# Altium schematic sheet Communication.SchDoc: Communication
size A4; DrawnBy: Alvin Ha; DocumentNumber: MCU2018-4; Revision: 2.0; SheetNumber: 4; SheetTotal: 4
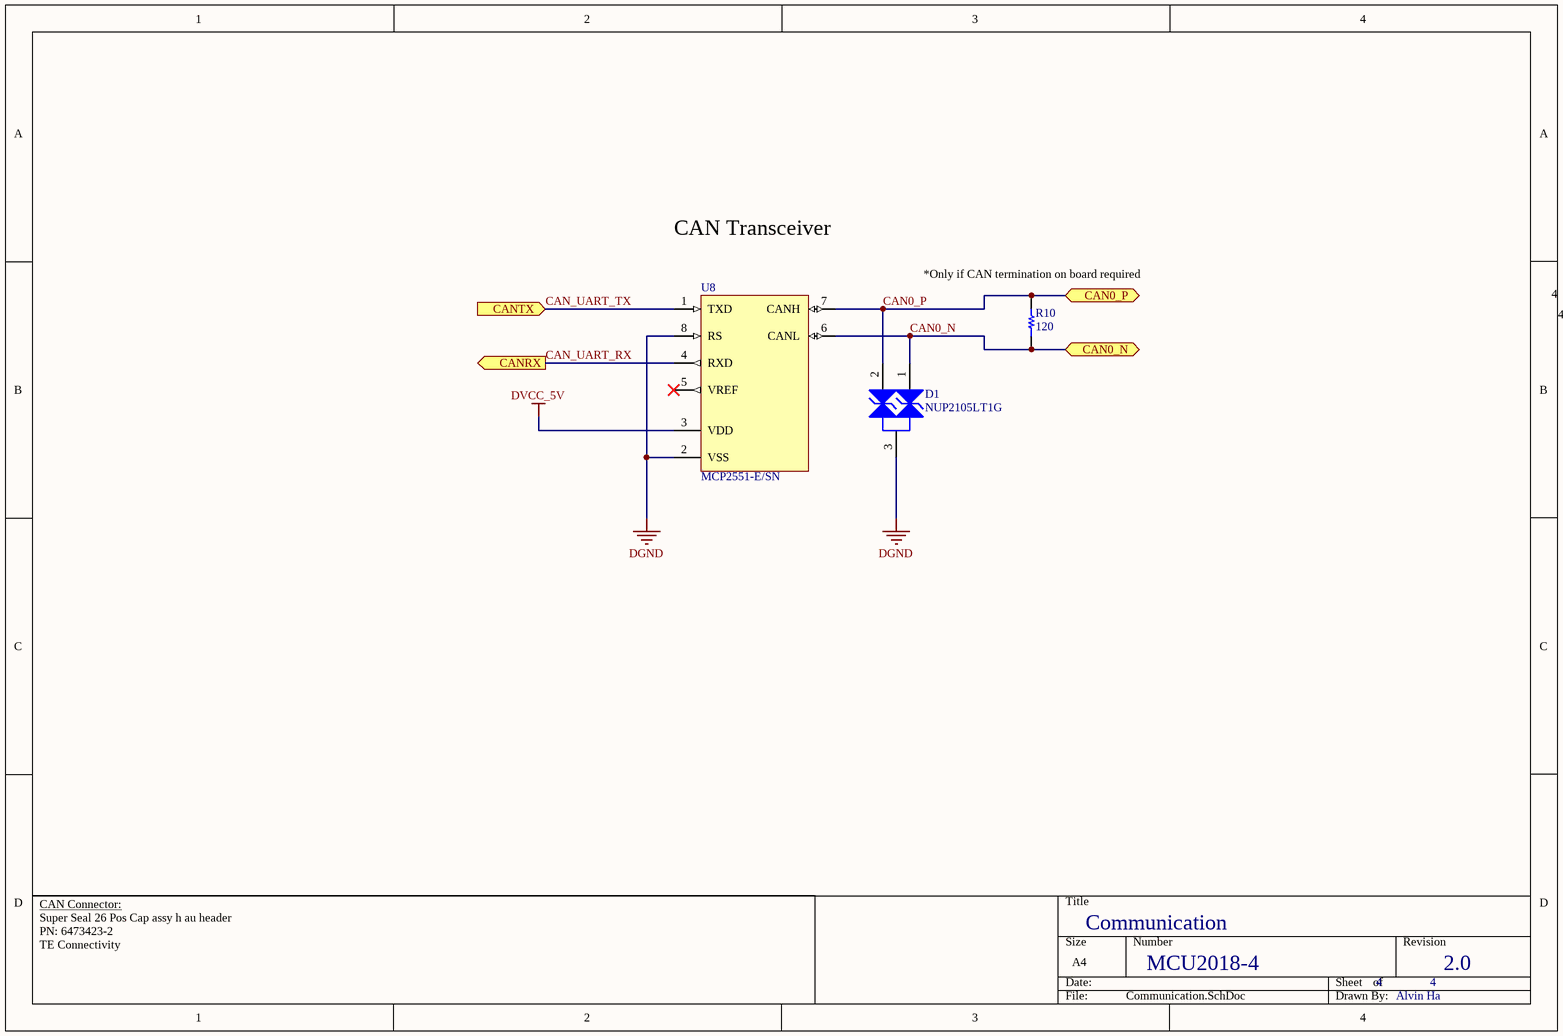
[diagram p0: Communication.SchDoc]

## Parts
D1  NUP2105LT1G  [ONSC-SOT-23-3-318-08_V]
R10  120  [RES SMT 0805]
U8  MCP2551-E/SN  [SOIC-SN8_N]

## Ports
CAN0_N (bidir), CAN0_P (bidir), CANRX (out), CANTX (in)

## Nets
DGND: D1.3(K) U8.2(VSS) U8.8(RS)
DVCC_5V: U8.3(VDD)
CAN0_N: D1.1(K) R10.1 U8.6(CANL) ; port CAN0_N
CAN0_P: D1.2(K) R10.2 U8.7(CANH) ; port CAN0_P
CAN_UART_RX: U8.4(RXD) ; port CANRX
CAN_UART_TX: U8.1(TXD) ; port CANTX

Not connected (* = marked no-connect by the designer): U8 5(VREF)*

## Notes on the sheet
- CAN Transceiver
- (near R10) *Only if CAN termination on board required
- CAN Connector:
- Super Seal 26 Pos Cap assy h au header
  PN: 6473423-2
  TE Connectivity

## Library data of the parts
D1 = CMP-1063-00164-1: Dual Line CAN Bus Protector, 3-Pin SOT-23, Pb-Free, Tape and Reel; Manufacturer: On Semiconductor; IR Max (uA): 0.1; Number of Lines: 2; Direction: Bidirectional; C Max (pF): 30; PPK Max (W): 350; V(BR) Min (V): 26.2; ComponentLink3URL: http://www.onsemi.cn/pub_link/Collateral/318-08.PDF; Mounting Technology: Surface Mount; ComponentLink2Description: Datasheet; PartNumber: NUP2105LT1G; ComponentLink1URL: http://www.onsemi.com/; PackageVersion: Rev. AP, 11/2009; DatasheetVersion: Rev. 5; RoHS: Pb-Free; PackageReference: SOT-23-3-318-08; ComponentLink2URL: http://www.onsemi.cn/pub_link/Collateral/NUP2105L-D.PDF; ComponentLink1Description: Manufacturer URL; PackageDescription: 3-Pin Small Outline Transistor, Body 2.92 x 1.3 mm, Pitch 0.95 mm; Packing: Tape and Reel; ComponentLink3Description: Package Specification
R10 = Resistor 120 1% 0805: Supplier 1: Digi-Key; Supplier Part Number 1: 541-120CDKR-ND
U8 = CMP-0186-00038-2: High-Speed CAN Transceiver, 8-Pin SOIC, Extended Temperature; PackageReference: SOIC-SN8; Code_JEDEC: MS-012; ComponentLink1Description: Manufacturer URL; ComponentLink1URL: http://www.microchip.com/; PackageVersion: revBB, Aug-2009; ComponentLink3Description: Package Specification; Code_IPC: SOIC127P600-8; ComponentLink2URL: http://ww1.microchip.com/downloads/en/DeviceDoc/21667F.pdf; RevisionNote: URLs added. DatasheetVersion updated.; ComponentLink3URL: http://www.microchip.com/stellent/groups/techpub_sg/documents/packagingspec/en012702.pdf; DatasheetVersion: revF, Jul-2010; ComponentLink2Description: Datasheet; PackageDescription: 8-Lead Plastic Small Outline (SN) - Narrow, 3.90mm Body [SOIC]